# Altium project PCB_Project.PrjPcb
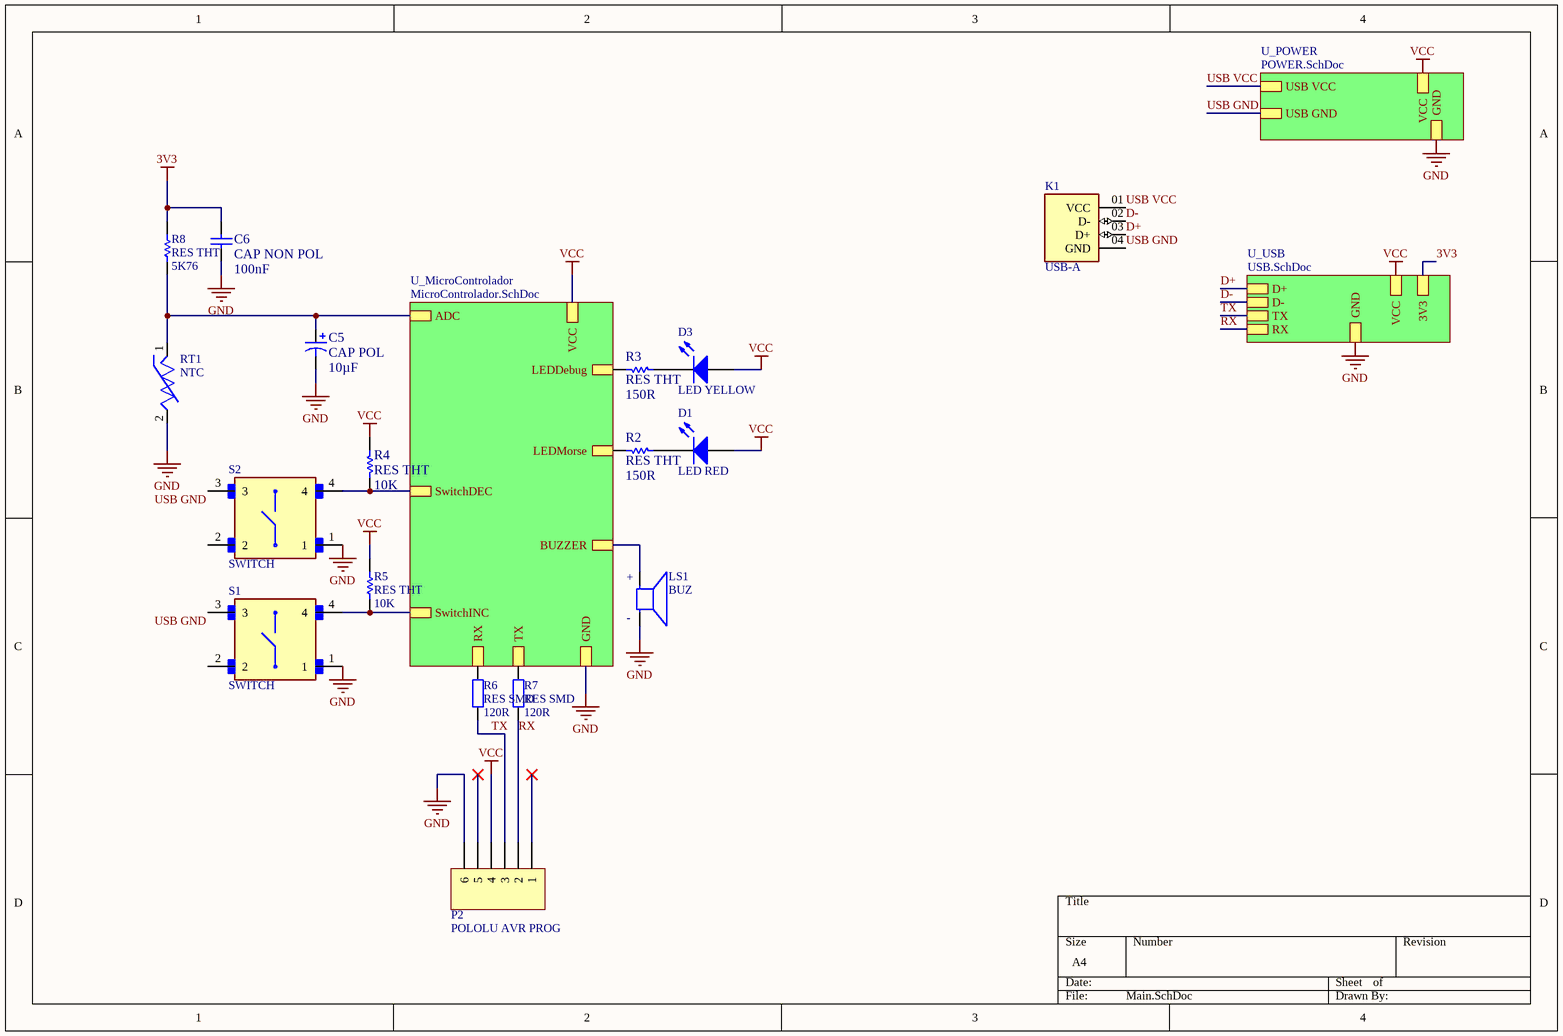
[diagram p0: Main.SchDoc]
4 sheets, 34 parts. Net scope: hierarchical (ports join the sheet entries above them; power ports are global).
Board file: PCB.PcbDoc
Sheets:
  Main.SchDoc
    U_MicroControlador = MicroControlador.SchDoc
    U_POWER = POWER.SchDoc
    U_USB = USB.SchDoc

## Sheet Main.SchDoc
size A4; SheetNumber: 1; SheetTotal: 4

### Parts
C5  CAP POL  value 10µF  [CONDENS 10uF]
C6  CAP NON POL  value 100nF  [Capacitor 100nF]
D1  LED RED  [LED 5mm]
D3  LED YELLOW  [LED 5mm]
K1  USB-A  [USB]
LS1  BUZ  [BUZZ]
P2  POLOLU AVR PROG  [Connector Header 1x6]
R2  RES THT  value 150R  [RESISTENCIA]
R3  RES THT  value 150R  [RESISTENCIA]
R4  RES THT  value 10K  [RESISTENCIA]
R5  RES THT  value 10K  [RESISTENCIA]
R6  RES SMD  value 120R  [RES SMDD]
R7  RES SMD  value 120R  [RES SMDD]
R8  RES THT  value 5K76  [RESISTENCIA]
RT1  NTC  [NTC]
S1  SWITCH  [Switch Tactile]
S2  SWITCH  [Switch Tactile]

### Sub-sheets
U_MicroControlador = MicroControlador.SchDoc: VCC, GND, LEDDebug, LEDMorse, SwitchINC, SwitchDEC, RX, TX, BUZZER, ADC
U_POWER = POWER.SchDoc: VCC, GND, USB VCC, USB GND
U_USB = USB.SchDoc: D+, D-, TX, RX, VCC, GND, 3V3

### Nets
3V3: C6.2 R8.2 ; sheet U_USB/3V3
USB GND: C5.2 C6.1 K1.04(GND) LS1.N P2.6 RT1.2 S1.1 S1.3 S2.1 S2.3 ; sheet U_MicroControlador/GND, sheet U_POWER/GND, sheet U_POWER/USB GND, sheet U_USB/GND  [also labelled GND]
VCC: D1.1(A) D3.1(A) P2.4 R4.1 R5.1 ; sheet U_MicroControlador/VCC, sheet U_POWER/VCC, sheet U_USB/VCC
D+: K1.03(D+) ; sheet U_USB/D+
D-: K1.02(D-) ; sheet U_USB/D-
RX: P2.2 R7.1 ; sheet U_USB/RX
TX: P2.3 R6.1 ; sheet U_USB/TX
USB VCC: K1.01(VCC) ; sheet U_POWER/USB VCC
NetAM1_2: R6.2 ; sheet U_MicroControlador/RX
NetAM1_3: R7.2 ; sheet U_MicroControlador/TX
NetAM1_4: R4.2 S2.4 ; sheet U_MicroControlador/SwitchDEC
NetAM1_6: R5.2 S1.4 ; sheet U_MicroControlador/SwitchINC
NetAM1_12: R2.1 ; sheet U_MicroControlador/LEDMorse
NetAM1_13: R3.1 ; sheet U_MicroControlador/LEDDebug
NetAM1_15: LS1.P ; sheet U_MicroControlador/BUZZER
NetAM1_23: C5.1 R8.1 RT1.1 ; sheet U_MicroControlador/ADC
NetD1_2: D1.2(K) R2.2
NetD3_2: D3.2(K) R3.2

Not connected (* = marked no-connect by the designer): P2 1* 5*; S1 2; S2 2

### Notes on the sheet
- (in symbol BUZ) +; -

### Library data of the parts
C5 = Cap Pol2: Polarized Capacitor (Axial); Published: 8-Jun-2000; LatestRevisionDate: 17-Jul-2002; LatestRevisionNote: Re-released for DXP Platform.; PackageReference: POLAR0.8; Publisher: Altium Limited; PackageDescription: Polarized Capacitor; 2 Leads
C6 = Cap: Capacitor; Published: 8-Jun-2000; LatestRevisionDate: 17-Jul-2002; LatestRevisionNote: Re-released for DXP Platform.; PackageReference: RAD-0.3; Publisher: Altium Limited; PackageDescription: Radial Cap, Thru-Hole; 2 Leads; 0.3 in Pin Spacing
D1 D3 = LED1: Typical RED GaAs LED; Published: 8-Jun-2000; LatestRevisionDate: 08-Jul-2005; LatestRevisionNote: Mech Layer 1 removed.; PackageReference: LED-1; Publisher: Altium Limited; PackageDescription: LED; 2 Leads
LS1 = BUZ: Magnetic Transducer Buzzer; Published: 24-Mar-1999; LatestRevisionDate: 17-Dec-2003; LatestRevisionNote: Schematic revised, PCB Footprint replaced.; DatasheetVersion: 17-Dec-2003; PackageReference: ABSM-1574; Publisher: Altium Limited; PackageDescription: Magnetic Transducer Buzzer; ComponentLink1Description: Manufacturer Link; ComponentLink1URL: http://www.megastar.com/linecard/buzzmode/index.php
P2 = Header 6: Header, 6-Pin; LatestRevisionDate: 17-Jul-2002; LatestRevisionNote: Re-released for DXP Platform.; Publisher: Altium Limited
R2-R5 R8 = Res1: Resistor; Published: 8-Jun-2000; LatestRevisionDate: 17-Jul-2002; LatestRevisionNote: Re-released for DXP Platform.; PackageReference: AXIAL-0.3; Publisher: Altium Limited; PackageDescription: Axial Device, Thru-Hole; 2 Leads; 0.3 in Pin Spacing
R6 R7 = RES SMD: Resistor; Published: 8-Jun-2000; LatestRevisionDate: 17-Jul-2002; LatestRevisionNote: Re-released for DXP Platform.; PackageReference: AXIAL-0.4; Publisher: Altium Limited; PackageDescription: Axial Device, Thru-Hole; 2 Leads; 0.4 in Pin Spacing
RT1 = NTC: Thermistor; Published: 24-Mar-1999; LatestRevisionDate: 29-May-2009; LatestRevisionNote: IPC-7351 Footprint Added.; PackageVersion: Mar-2003; PackageReference: 6-0805; Publisher: Altium Limited; PackageDescription: Chip Resistor 0805 Case Size; Code_IPC: RESC2012
S1 S2 = SW-DPST: Double-Pole, Single-Throw Switch; Published: 24-Mar-1999; LatestRevisionDate: 17-Jul-2002; LatestRevisionNote: Re-released for DXP Platform.; PackageReference: DPST-4; Publisher: Altium Limited; PackageDescription: Switch; 4 Leads

## Sheet MicroControlador.SchDoc
size A4; SheetNumber: 3; SheetTotal: 4; SPICEModelCacheTMNWFBLM: <root> / <DocumentId>TMNWFBLM</DocumentId> / </root>
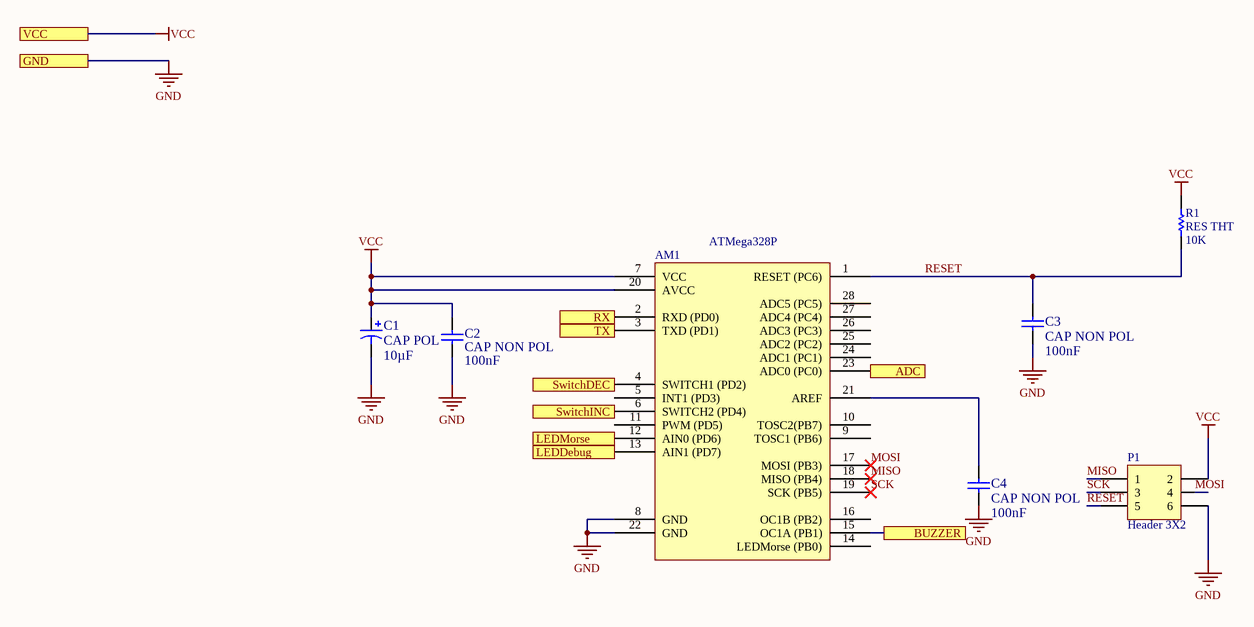
[diagram p1: MicroControlador.SchDoc]

### Parts
AM1  ATMega328P  [ATMega328P]
C1  CAP POL  value 10µF  [CONDENS 10uF]
C2  CAP NON POL  value 100nF  [Capacitor 100nF]
C3  CAP NON POL  value 100nF  [Capacitor 100nF]
C4  CAP NON POL  value 100nF  [Capacitor 100nF]
P1  Header 3X2  [Connector Header 3x2]
R1  RES THT  value 10K  [RESISTENCIA]

### Ports
ADC, BUZZER, GND, LEDDebug, LEDMorse, RX, SwitchDEC, SwitchINC, TX, VCC

### Nets
GND: AM1.8(GND) AM1.22(GND) C1.2 C2.2 C3.1 C4.1 P1.6 ; port GND  [project net USB GND]
VCC: AM1.7(VCC) AM1.20(AVCC) C1.1 C2.1 P1.2 R1.2 ; port VCC
MISO: AM1.18(MISO_(PB4)) P1.1
MOSI: AM1.17(MOSI_(PB3)) P1.4
RESET: AM1.1(RESET_(PC6)) C3.2 P1.5 R1.1
SCK: AM1.19(SCK_(PB5)) P1.3
NetAM1_2: AM1.2(RXD_(PD0)) ; port RX
NetAM1_3: AM1.3(TXD_(PD1)) ; port TX
NetAM1_4: AM1.4(SWITCH1_(PD2)) ; port SwitchDEC
NetAM1_6: AM1.6(SWITCH2_(PD4)) ; port SwitchINC
NetAM1_12: AM1.12(AIN0_(PD6)) ; port LEDMorse
NetAM1_13: AM1.13(AIN1_(PD7)) ; port LEDDebug
NetAM1_15: AM1.15(OC1A_(PB1)) ; port BUZZER
NetAM1_21: AM1.21(AREF) C4.2
NetAM1_23: AM1.23(ADC0_(PC0)) ; port ADC

Not connected (* = marked no-connect by the designer): AM1 5(INT1_(PD3)) 9(TOSC1_(PB6)) 10(TOSC2(PB7)) 11(PWM_(PD5)) 14(LEDMorse_(PB0)) 16(OC1B_(PB2)) 24(ADC1_(PC1)) 25(ADC2_(PC2)) 26(ADC3_(PC3)) 27(ADC4_(PC4)) 28(ADC5_(PC5))

### Library data of the parts
C1 = Cap Pol2: Polarized Capacitor (Axial); Published: 8-Jun-2000; LatestRevisionDate: 17-Jul-2002; LatestRevisionNote: Re-released for DXP Platform.; PackageReference: POLAR0.8; Publisher: Altium Limited; PackageDescription: Polarized Capacitor; 2 Leads
C2-C4 = Cap: Capacitor; Published: 8-Jun-2000; LatestRevisionDate: 17-Jul-2002; LatestRevisionNote: Re-released for DXP Platform.; PackageReference: RAD-0.3; Publisher: Altium Limited; PackageDescription: Radial Cap, Thru-Hole; 2 Leads; 0.3 in Pin Spacing
P1 = Header 3X2: Header, 3-Pin, Dual row; LatestRevisionDate: 17-Jul-2002; LatestRevisionNote: Re-released for DXP Platform.; Publisher: Altium Limited
R1 = Res1: Resistor; Published: 8-Jun-2000; LatestRevisionDate: 17-Jul-2002; LatestRevisionNote: Re-released for DXP Platform.; PackageReference: AXIAL-0.3; Publisher: Altium Limited; PackageDescription: Axial Device, Thru-Hole; 2 Leads; 0.3 in Pin Spacing

## Sheet POWER.SchDoc
size A4; SheetNumber: 2; SheetTotal: 4
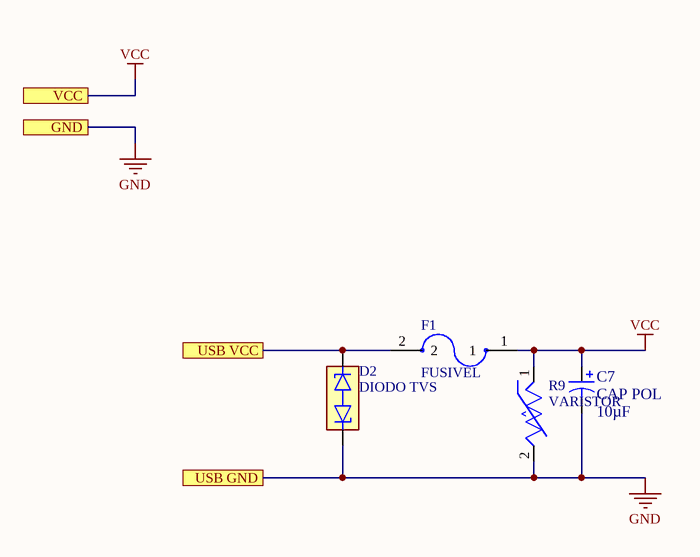
[diagram p2: POWER.SchDoc]

### Parts
C7  CAP POL  value 10µF  [CONDENS 10uF]
D2  DIODO TVS  [DIODO TVS]
F1  FUSIVEL  [FUSIVEL ARMADO 0.5A]
R9  VARISTOR  [VARISTOR]

### Ports
GND, USB GND, USB VCC, VCC

### Nets
GND: C7.2 D2.1 R9.2 ; port GND, port USB GND  [project net USB GND]
VCC: C7.1 F1.1 R9.1 ; port VCC
USB VCC: D2.2 F1.2 ; port USB VCC

### Library data of the parts
C7 = Cap Pol2: Polarized Capacitor (Axial); Published: 8-Jun-2000; LatestRevisionDate: 17-Jul-2002; LatestRevisionNote: Re-released for DXP Platform.; PackageReference: POLAR0.8; Publisher: Altium Limited; PackageDescription: Polarized Capacitor; 2 Leads
D2 = DIODO TVS: 1 Amp General Purpose Rectifier; Published: 8-Jun-2000; LatestRevisionDate: 17-Jul-2002; LatestRevisionNote: Re-released for DXP Platform.; DatasheetVersion: 1998; PackageVersion: Aug-1999; PackageReference: DO-41; Publisher: Altium Limited; PackageDescription: Diode, Axial; Body 5.2 x 2.7 mm (LxDia. max), Lead Dia. 0.86 mm (max); Code_JEDEC: DO-204-AL; ComponentLink1Description: Manufacturer Link; ComponentLink1URL: http://www.fairchildsemi.com/; ComponentLink2Description: Datasheet; ComponentLink2URL: http://www.fairchildsemi.com/ds/1N%2F1N4001.pdf
F1 = FUSIVEL ARMADO 0.5A: Fuse; Published: 8-Jun-2000; LatestRevisionDate: 17-Jul-2002; LatestRevisionNote: Re-released for DXP Platform.; PackageReference: PIN-W2/E2.8; Publisher: Altium Limited; PackageDescription: Thru-Hole; 2 Leads
R9 = VARISTOR: Varistor (Voltage-Sensitive Resistor); Published: 24-Mar-1999; LatestRevisionDate: 29-May-2009; LatestRevisionNote: IPC-7351 Footprint Added.; PackageVersion: Mar-2003; PackageReference: 6-0805; Publisher: Altium Limited; PackageDescription: Chip Resistor 0805 Case Size; Code_IPC: RESC2012

## Sheet USB.SchDoc
size A4; SheetNumber: 4; SheetTotal: 4
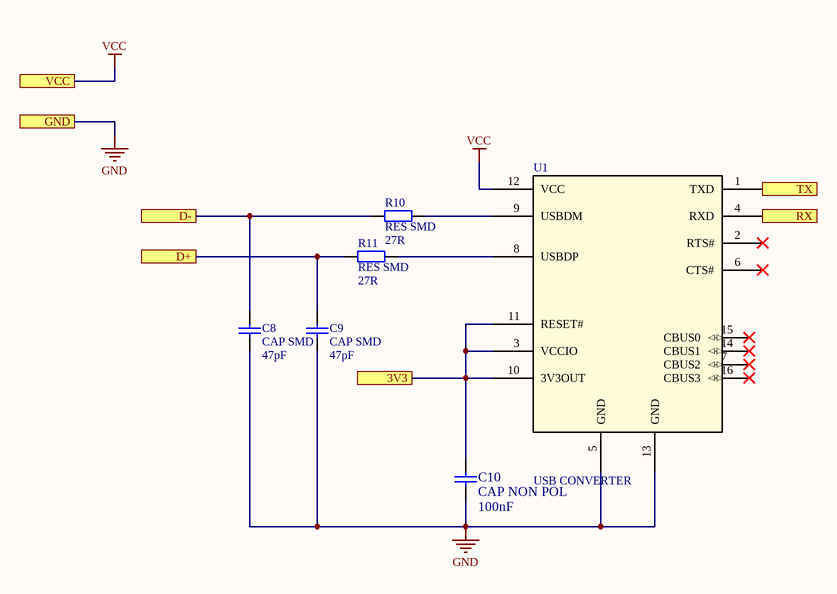
[diagram p3: USB.SchDoc]

### Parts
C8  CAP SMD  value 47pF  [CAP SMD]
C9  CAP SMD  value 47pF  [CAP SMD]
C10  CAP NON POL  value 100nF  [Capacitor 100nF]
R10  RES SMD  value 27R  [RES SMDD]
R11  RES SMD  value 27R  [RES SMDD]
U1  USB CONVERTER  [CONVERSOR USB PARA UART]

### Ports
3V3, D+, D-, GND, RX, TX, VCC

### Nets
3V3: C10.2 U1.3(VCCIO) U1.10(3V3OUT) U1.11(RESET#) ; port 3V3
GND: C8.2 C9.2 C10.1 U1.5(GND) U1.13(GND) ; port GND  [project net USB GND]
VCC: U1.12(VCC) ; port VCC
D+: C9.1 R11.1 ; port D+
D-: C8.1 R10.1 ; port D-
RX: U1.4(RXD) ; port RX
TX: U1.1(TXD) ; port TX
NetR10_2: R10.2 U1.9(USBDM)
NetR11_2: R11.2 U1.8(USBDP)

Not connected (* = marked no-connect by the designer): U1 2(RTS#)* 6(CTS#)* 7(CBUS2)* 14(CBUS1)* 15(CBUS0)* 16(CBUS3)*

### Library data of the parts
C8 C9 = CONDENSADOR SMD: Capacitor (Semiconductor SIM Model); Published: 8-Jun-2000; LatestRevisionDate: 29-May-2009; LatestRevisionNote: IPC-7351 Footprint Added.; PackageReference: C1206; Publisher: Altium Limited; PackageDescription: Chip Capacitor
C10 = Cap: Capacitor; Published: 8-Jun-2000; LatestRevisionDate: 17-Jul-2002; LatestRevisionNote: Re-released for DXP Platform.; PackageReference: RAD-0.3; Publisher: Altium Limited; PackageDescription: Radial Cap, Thru-Hole; 2 Leads; 0.3 in Pin Spacing
R10 R11 = RES SMD: Resistor; Published: 8-Jun-2000; LatestRevisionDate: 17-Jul-2002; LatestRevisionNote: Re-released for DXP Platform.; PackageReference: AXIAL-0.4; Publisher: Altium Limited; PackageDescription: Axial Device, Thru-Hole; 2 Leads; 0.4 in Pin Spacing
U1 = FT230XS-R: No Description Available; Mfr_Name: FTDI, Future Technology Devices International Ltd; Copyright: Copyright (C) 2023 Ultra Librarian. All rights reserved.; Manufacturer_Part_Number: FT230XS-R; RefDes: RefDes; Type: DEV

## Nets that join several sheets
3V3: Main (C6.2 R8.2), USB (C10.2 U1.3 U1.10 U1.11)
USB GND: Main (10 pins), MicroControlador (7 pins), POWER (C7.2 D2.1 R9.2), USB (5 pins)
VCC: Main (5 pins), MicroControlador (6 pins), POWER (C7.1 F1.1 R9.1), USB (U1.12)
D+: Main (K1.03), USB (C9.1 R11.1)
D-: Main (K1.02), USB (C8.1 R10.1)
NetAM1_2: Main (R6.2), MicroControlador (AM1.2)
NetAM1_3: Main (R7.2), MicroControlador (AM1.3)
NetAM1_4: Main (R4.2 S2.4), MicroControlador (AM1.4)
NetAM1_6: Main (R5.2 S1.4), MicroControlador (AM1.6)
NetAM1_12: Main (R2.1), MicroControlador (AM1.12)
NetAM1_13: Main (R3.1), MicroControlador (AM1.13)
NetAM1_15: Main (LS1.P), MicroControlador (AM1.15)
NetAM1_23: Main (C5.1 R8.1 RT1.1), MicroControlador (AM1.23)
RX: Main (P2.2 R7.1), USB (U1.4)
TX: Main (P2.3 R6.1), USB (U1.1)
USB VCC: Main (K1.01), POWER (D2.2 F1.2)